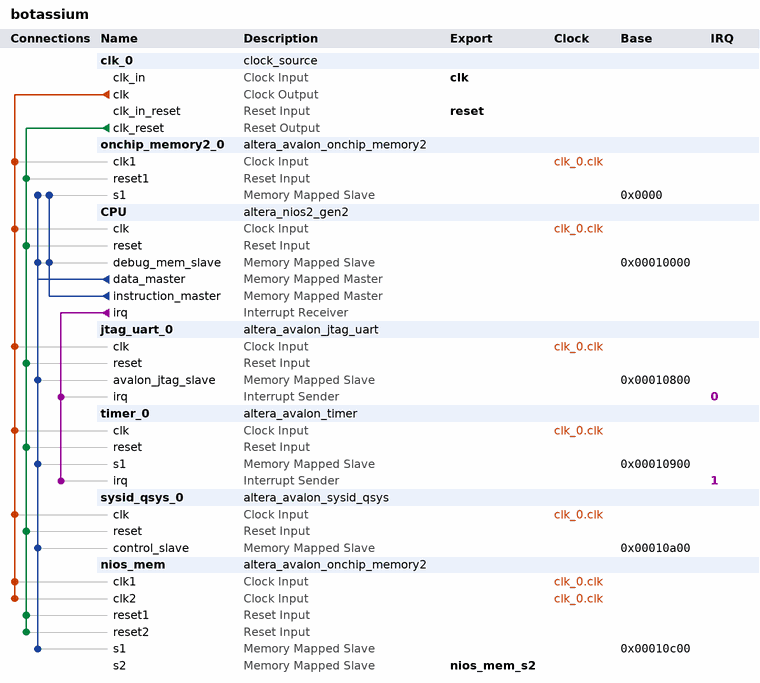
[diagram p0: system contents]
# Platform Designer (Qsys) system botassium, Cyclone IV E EP4CE22F17C6
# Parameters at their usual value, and those the tool derives, are not listed.
package require -exact qsys 18.1
create_system botassium
set_project_property DEVICE_FAMILY {Cyclone IV E}
set_project_property DEVICE EP4CE22F17C6

add_instance clk_0 clock_source 18.1
set_instance_parameter_value clk_0 clockFrequency 50000000

add_instance onchip_memory2_0 altera_avalon_onchip_memory2 18.1
set_instance_parameter_value onchip_memory2_0 dataWidth 32
set_instance_parameter_value onchip_memory2_0 dualPort false
set_instance_parameter_value onchip_memory2_0 initMemContent true
set_instance_parameter_value onchip_memory2_0 initializationFileName onchip_mem.hex
set_instance_parameter_value onchip_memory2_0 memorySize 20000

add_instance CPU altera_nios2_gen2 18.1
set_instance_parameter_value CPU dcache_size 2048
set_instance_parameter_value CPU exceptionSlave onchip_memory2_0.s1
set_instance_parameter_value CPU icache_size 4096
set_instance_parameter_value CPU impl Tiny
set_instance_parameter_value CPU resetSlave onchip_memory2_0.s1

add_instance jtag_uart_0 altera_avalon_jtag_uart 18.1
set_instance_parameter_value jtag_uart_0 simInteractiveOptions NO_INTERACTIVE_WINDOWS

add_instance timer_0 altera_avalon_timer 18.1
set_instance_parameter_value timer_0 period 1
set_instance_parameter_value timer_0 periodUnits MSEC

add_instance sysid_qsys_0 altera_avalon_sysid_qsys 18.1
set_instance_parameter_value sysid_qsys_0 id 105

add_instance nios_mem altera_avalon_onchip_memory2 18.1
set_instance_parameter_value nios_mem dataWidth 32
set_instance_parameter_value nios_mem dualPort true
set_instance_parameter_value nios_mem initMemContent true
set_instance_parameter_value nios_mem initializationFileName onchip_mem.hex
set_instance_parameter_value nios_mem memorySize 512

# connections
add_connection clk_0.clk CPU.clk clock
add_connection clk_0.clk jtag_uart_0.clk clock
add_connection clk_0.clk nios_mem.clk1 clock
add_connection clk_0.clk nios_mem.clk2 clock
add_connection clk_0.clk onchip_memory2_0.clk1 clock
add_connection clk_0.clk sysid_qsys_0.clk clock
add_connection clk_0.clk timer_0.clk clock
add_connection clk_0.clk_reset CPU.reset reset
add_connection clk_0.clk_reset jtag_uart_0.reset reset
add_connection clk_0.clk_reset nios_mem.reset1 reset
add_connection clk_0.clk_reset nios_mem.reset2 reset
add_connection clk_0.clk_reset onchip_memory2_0.reset1 reset
add_connection clk_0.clk_reset sysid_qsys_0.reset reset
add_connection clk_0.clk_reset timer_0.reset reset
add_connection CPU.data_master CPU.debug_mem_slave avalon
set_connection_parameter_value CPU.data_master/CPU.debug_mem_slave baseAddress 0x00010000
add_connection CPU.data_master jtag_uart_0.avalon_jtag_slave avalon
set_connection_parameter_value CPU.data_master/jtag_uart_0.avalon_jtag_slave baseAddress 0x00010800
add_connection CPU.data_master nios_mem.s1 avalon
set_connection_parameter_value CPU.data_master/nios_mem.s1 baseAddress 0x00010c00
add_connection CPU.data_master onchip_memory2_0.s1 avalon
set_connection_parameter_value CPU.data_master/onchip_memory2_0.s1 baseAddress 0x0000
add_connection CPU.data_master sysid_qsys_0.control_slave avalon
set_connection_parameter_value CPU.data_master/sysid_qsys_0.control_slave baseAddress 0x00010a00
add_connection CPU.data_master timer_0.s1 avalon
set_connection_parameter_value CPU.data_master/timer_0.s1 baseAddress 0x00010900
add_connection CPU.instruction_master CPU.debug_mem_slave avalon
set_connection_parameter_value CPU.instruction_master/CPU.debug_mem_slave baseAddress 0x00010000
add_connection CPU.instruction_master onchip_memory2_0.s1 avalon
set_connection_parameter_value CPU.instruction_master/onchip_memory2_0.s1 baseAddress 0x0000
add_connection CPU.irq jtag_uart_0.irq interrupt
set_connection_parameter_value CPU.irq/jtag_uart_0.irq irqNumber 0
add_connection CPU.irq timer_0.irq interrupt
set_connection_parameter_value CPU.irq/timer_0.irq irqNumber 1

# exported interfaces
add_interface clk clock sink
set_interface_property clk EXPORT_OF clk_0.clk_in
add_interface nios_mem_s2 avalon slave
set_interface_property nios_mem_s2 EXPORT_OF nios_mem.s2
add_interface reset reset sink
set_interface_property reset EXPORT_OF clk_0.clk_in_reset

set_interconnect_requirement {$system} qsys_mm.clockCrossingAdapter HANDSHAKE
set_interconnect_requirement {$system} qsys_mm.enableEccProtection FALSE
set_interconnect_requirement {$system} qsys_mm.insertDefaultSlave FALSE
set_interconnect_requirement {$system} qsys_mm.maxAdditionalLatency 1

save_system botassium.qsys
